# EAGLE design version1c (EAGLE 6.5.0)
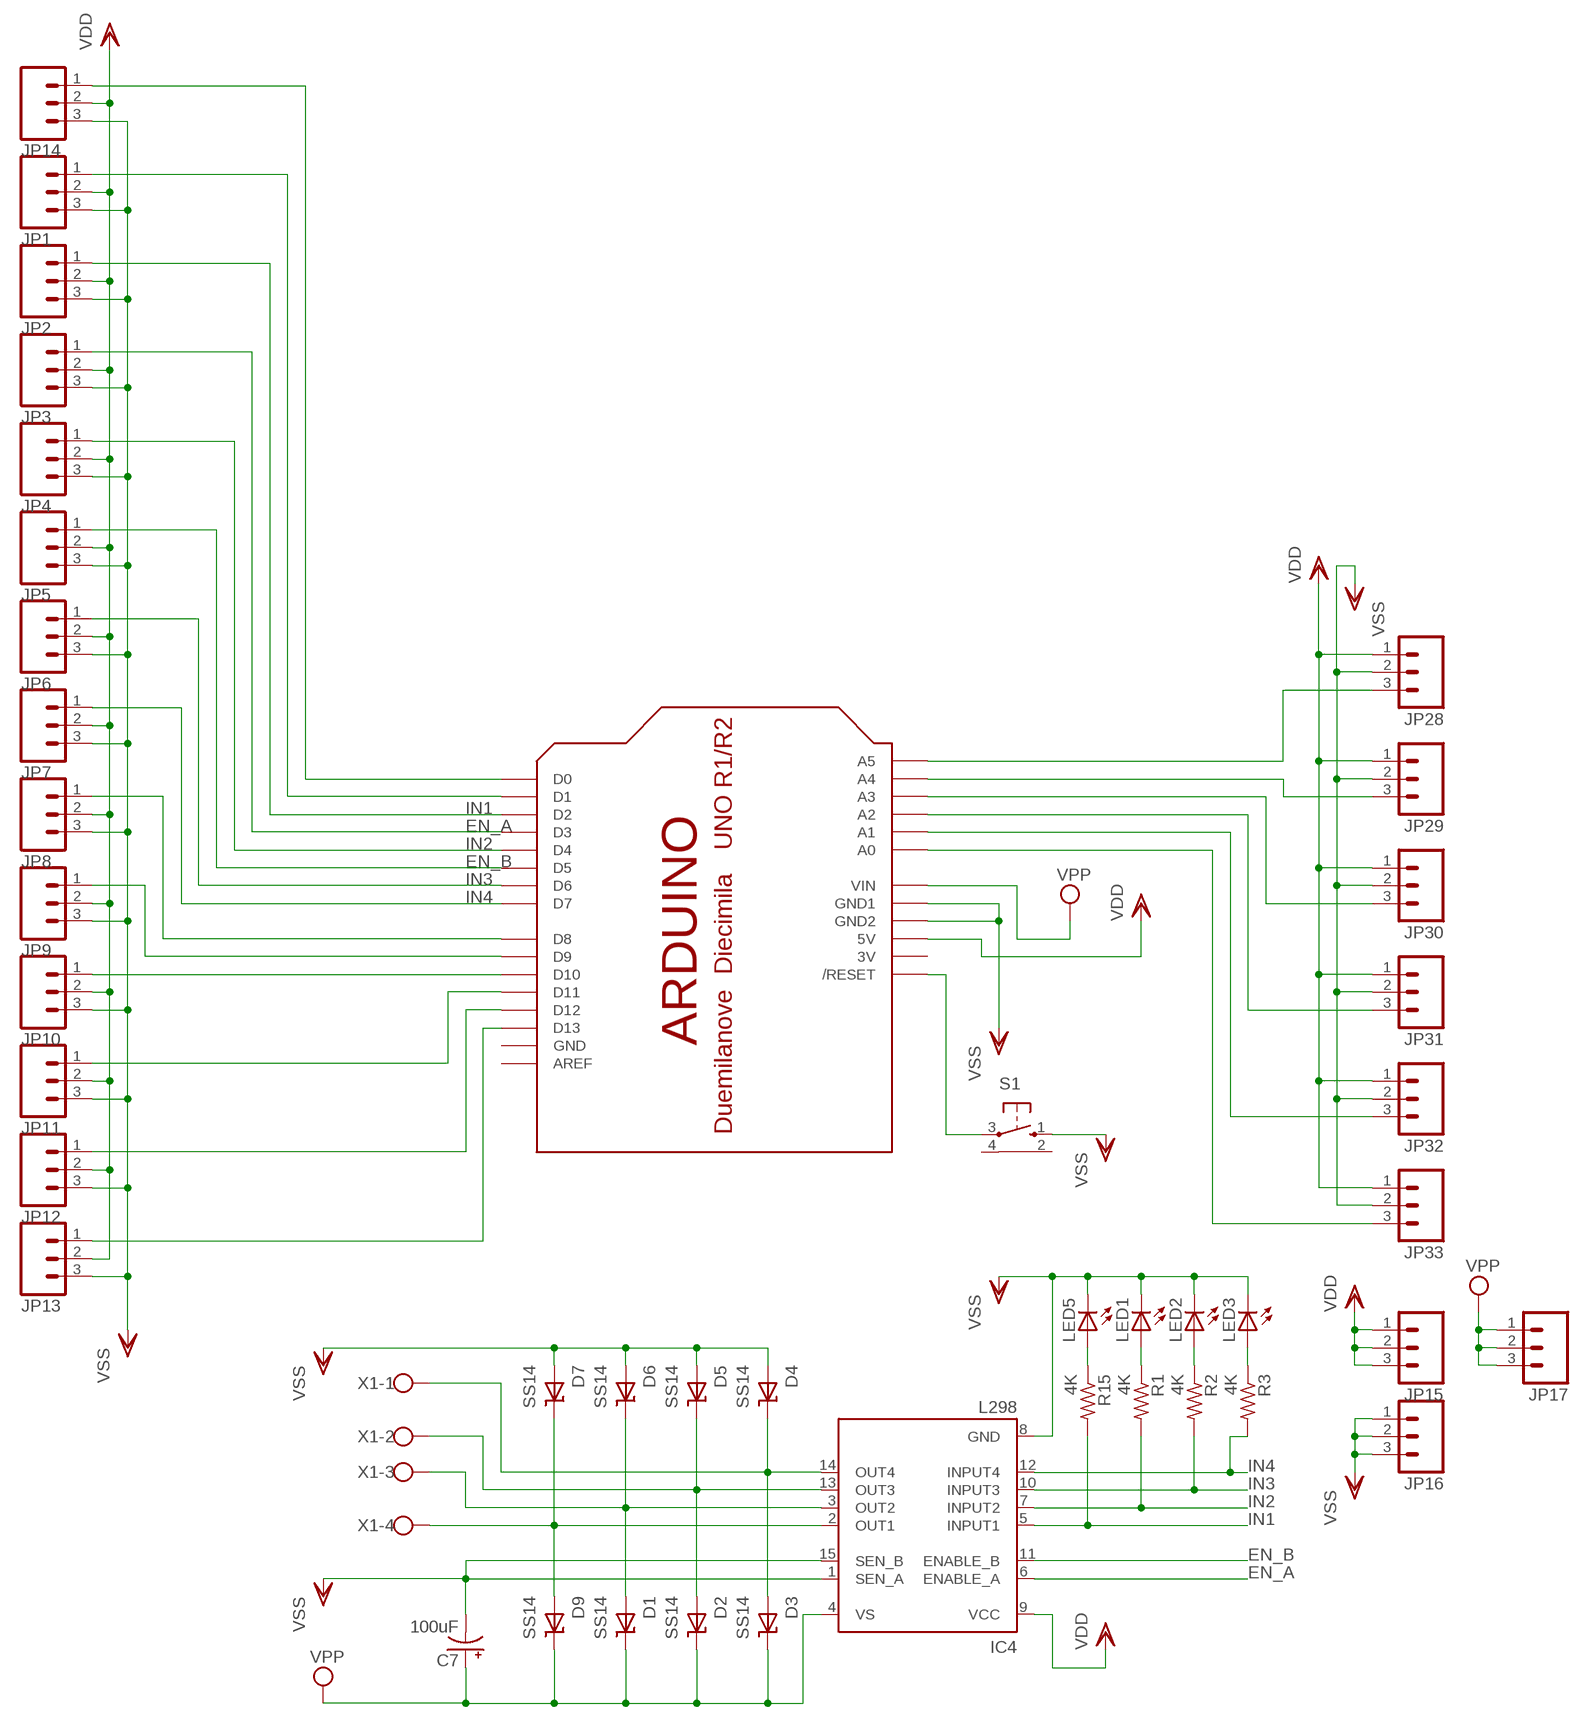
[diagram p0: schematic, sheet 1]

## Parts
C7  100uF  CPOL-US153CLV-0605  [153CLV-0605]
D1  SS14  [SMA]
D2  SS14  [SMA]
D3  SS14  [SMA]
D4  SS14  [SMA]
D5  SS14  [SMA]
D6  SS14  [SMA]
D7  SS14  [SMA]
D9  SS14  [SMA]
IC4  L298  [MULTIWATT-15]
JP1  M03PTH  [1X03]
JP2  M03PTH  [1X03]
JP3  M03PTH  [1X03]
JP4  M03PTH  [1X03]
JP5  M03PTH  [1X03]
JP6  M03PTH  [1X03]
JP7  M03PTH  [1X03]
JP8  M03PTH  [1X03]
JP9  M03PTH  [1X03]
JP10  M03PTH  [1X03]
JP11  M03PTH  [1X03]
JP12  M03PTH  [1X03]
JP13  M03PTH  [1X03]
JP14  M03PTH  [1X03]
JP15  M03PTH  [1X03]
JP16  M03PTH  [1X03]
JP17  M03PTH  [1X03]
JP28  M03PTH  [1X03]
JP29  M03PTH  [1X03]
JP30  M03PTH  [1X03]
JP31  M03PTH  [1X03]
JP32  M03PTH  [1X03]
JP33  M03PTH  [1X03]
LED1  LEDCHIP-LED0805  [CHIP-LED0805]
LED2  LEDCHIP-LED0805  [CHIP-LED0805]
LED3  LEDCHIP-LED0805  [CHIP-LED0805]
LED5  LEDCHIP-LED0805  [CHIP-LED0805]
R1  4K  R-US_R0805  [R0805]
R2  4K  R-US_R0805  [R0805]
R3  4K  R-US_R0805  [R0805]
R15  4K  R-US_R0805  [R0805]
S1  10-XX-RPAD  [B3F-10XX-RPAD]
U$1  ARDUINO-NOHOLE  [ARDUINO-NOHOLE]
X1  W237-4  [W237-4]

## Nets
EN_A: IC4.6(ENABLE_A) JP3.1 U$1.D3
EN_B: IC4.11(ENABLE_B) JP5.1 U$1.D5
IN1: IC4.5(INPUT1) JP2.1 R15.2 U$1.D2
IN2: IC4.7(INPUT2) JP4.1 R1.2 U$1.D4
IN3: IC4.10(INPUT3) JP6.1 R2.2 U$1.D6
IN4: IC4.12(INPUT4) JP7.1 R3.2 U$1.D7
N$1: JP13.1 U$1.D13
N$2: JP12.1 U$1.D12
N$3: JP28.3 U$1.A5
N$4: JP11.1 U$1.D11
N$5: JP10.1 U$1.D10
N$6: JP29.3 U$1.A4
N$7: JP9.1 U$1.D9
N$8: JP8.1 U$1.D8
N$9: JP30.3 U$1.A3
N$10: LED3.A R3.1
N$11: LED2.A R2.1
N$12: JP31.3 U$1.A2
N$13: LED1.A R1.1
N$14: LED5.A R15.1
N$16: JP33.3 U$1.A0
N$17: JP32.3 U$1.A1
N$19: JP1.1 U$1.D1
N$20: JP14.1 U$1.D0
N$22: S1.3(P) U$1.RESET(/RESET)
N$24: D7.P$1(K) D9.P$2(A) IC4.2(OUT1) X1.4
N$25: D1.P$2(A) D6.P$1(K) IC4.3(OUT2) X1.3
N$27: D2.P$2(A) D5.P$1(K) IC4.13(OUT3) X1.2
N$28: D3.P$2(A) D4.P$1(K) IC4.14(OUT4) X1.1
VDD: IC4.9(VCC) JP1.2 JP2.2 JP3.2 JP4.2 JP5.2 JP6.2 JP7.2 JP8.2 JP9.2 JP10.2 JP11.2 JP12.2 JP13.2 JP14.2 JP15.1 JP15.2 JP15.3 JP28.1 JP29.1 JP30.1 JP31.1 JP32.1 JP33.1 U$1.5V
VPP: C7.+ D1.P$1(K) D2.P$1(K) D3.P$1(K) D9.P$1(K) IC4.4(VS) JP17.1 JP17.2 JP17.3 U$1.VIN
VSS: C7.- D4.P$2(A) D5.P$2(A) D6.P$2(A) D7.P$2(A) IC4.1(SEN_A) IC4.8(GND) IC4.15(SEN_B) JP1.3 JP2.3 JP3.3 JP4.3 JP5.3 JP6.3 JP7.3 JP8.3 JP9.3 JP10.3 JP11.3 JP12.3 JP13.3 JP14.3 JP16.1 JP16.2 JP16.3 JP28.2 JP29.2 JP30.2 JP31.2 JP32.2 JP33.2 LED1.C LED2.C LED3.C LED5.C S1.1(S) U$1.GND1 U$1.GND2
Unconnected: S1.2(GND1) S1.4(GND2) U$1.AREF

## Power pins joined to a net without a drawn wire
3V: U$1.3V
GND: U$1.GND

## Library data of the parts
C7 = adafruit:CPOL-US: POLARIZED CAPACITOR, American symbol
D1-D7 D9 = SmartPrj:SS14: DIODE SS14 Diode Schottky 1A 40v
IC4 = st-microelectronics:L298: DUAL FULL-BRIDGE DRIVER; MPN: L298N; OC_FARNELL: 1589425; OC_NEWARK: 32M1527
JP1-JP17 JP28-JP33 = SparkFun:M03: Header 3 Standard 3-pin 0.1" header. Use with straight break away headers (SKU : PRT-00116), right angle break away headers (PRT-00553), swiss pins (PRT-00743), machine pins (PRT-00117), and female headers (PRT-00115). Molex polarized connector foot print use with SKU : PRT-08232 with associated crimp pins and housings.
LED1-LED3 LED5 = led:LED: LED OSRAM: - CHIPLED LG R971, LG N971, LY N971, LG Q971, LY Q971, LO R971, LY R971 LH N974, LH R974 LS Q976, LO Q976, LY Q976 LO Q996 - Hyper CHIPLED LW Q18S LB Q993, LB Q99A, LB R99A - SideLED LS A670, LO A670, LY A670, LG A670, LP A670 LB A673, LV A673, LT A673, LW A673 LH A674 LY A675 LS A676, LA A676, LO A676, LY A676, LW A676 LS A679, LY A679, LG A679 - Hyper Micro SIDELED® LS Y876, LA Y876, LO Y876, LY Y876 LT Y87S - SmartLED LW L88C, LW L88S LB L89C, LB L89S, LG L890 LS L89K, LO L89K, LY L89K LS L896, LA L896, LO L896, LY L896 - TOPLED LS T670, LO T670, LY T670, LG T670, LP T670 LSG T670, LSP T670, LSY T670, LOP T670, LYG T670 LG T671, LOG T671, LSG T671 LB T673, LV T673, LT T673, LW T673 LH T674 LS T676, LA T676, LO T676, LY T676, LB T676, LH T676, LSB T676, LW T676 LB T67C, LV T67C, LT T67C, LS T67K, LO T67K, LY T67K, LW E67C LS E67B, LA E67B, LO E67B, LY E67B, LB E67C, LV E67C, LT E67C LW T67C LS T679, LY T679, LG T679 LS T770, LO T770, LY T770, LG T770, LP T770 LB T773, LV T773, LT T773, LW T773 LH T774 LS E675, LA E675, LY E675, LS T675 LS T776, LA T776, LO T776, LY T776, LB T776 LHGB T686 LT T68C, LB T68C - Hyper Mini TOPLED® LB M676 - Mini TOPLED Santana® LG M470 LS M47K, LO M47K, LY M47K Source: http://www.osram.convergy.de LUXEON: - LUMILED® LXK2-PW12-R00, LXK2-PW12-S00, LXK2-PW14-U00, LXK2-PW14-V00 LXK2-PM12-R00, LXK2-PM12-S00, LXK2-PM14-U00 LXK2-PE12-Q00, LXK2-PE12-R00, LXK2-PE12-S00, LXK2-PE14-T00, LXK2-PE14-U00 LXK2-PB12-K00, LXK2-PB12-L00, LXK2-PB12-M00, LXK2-PB14-N00, LXK2-PB14-P00, LXK2-PB14-Q00 LXK2-PR12-L00, LXK2-PR12-M00, LXK2-PR14-Q00, LXK2-PR14-R00 LXK2-PD12-Q00, LXK2-PD12-R00, LXK2-PD12-S00 LXK2-PH12-R00, LXK2-PH12-S00 LXK2-PL12-P00, LXK2-PL12-Q00, LXK2-PL12-R00 Source: www.luxeon.com KINGBRIGHT: KA-3528ASYC Source: www.kingbright.com
R1-R3 R15 = adafruit:R-US_: RESISTOR, American symbol
S1 = repRapr:10-XX-RPAD: OMRON SWITCH
U$1 = adafruit:ARDUINO: Arduino Diecimila/Duemilanove Make a shield with ease, this package has all the named pins as well as the two mounting drill holes and an outline of the USB and DC power connector. The outline is on the DIMENSION layer, so if your board house uses it they will cut the outline to match. http://www.ladyada.net/library/pcb/eaglelibrary.html
X1 = con-wago-500:W237-4: WAGO SCREW CLAMP; OC_FARNELL: unknown; OC_NEWARK: unknown

## Board
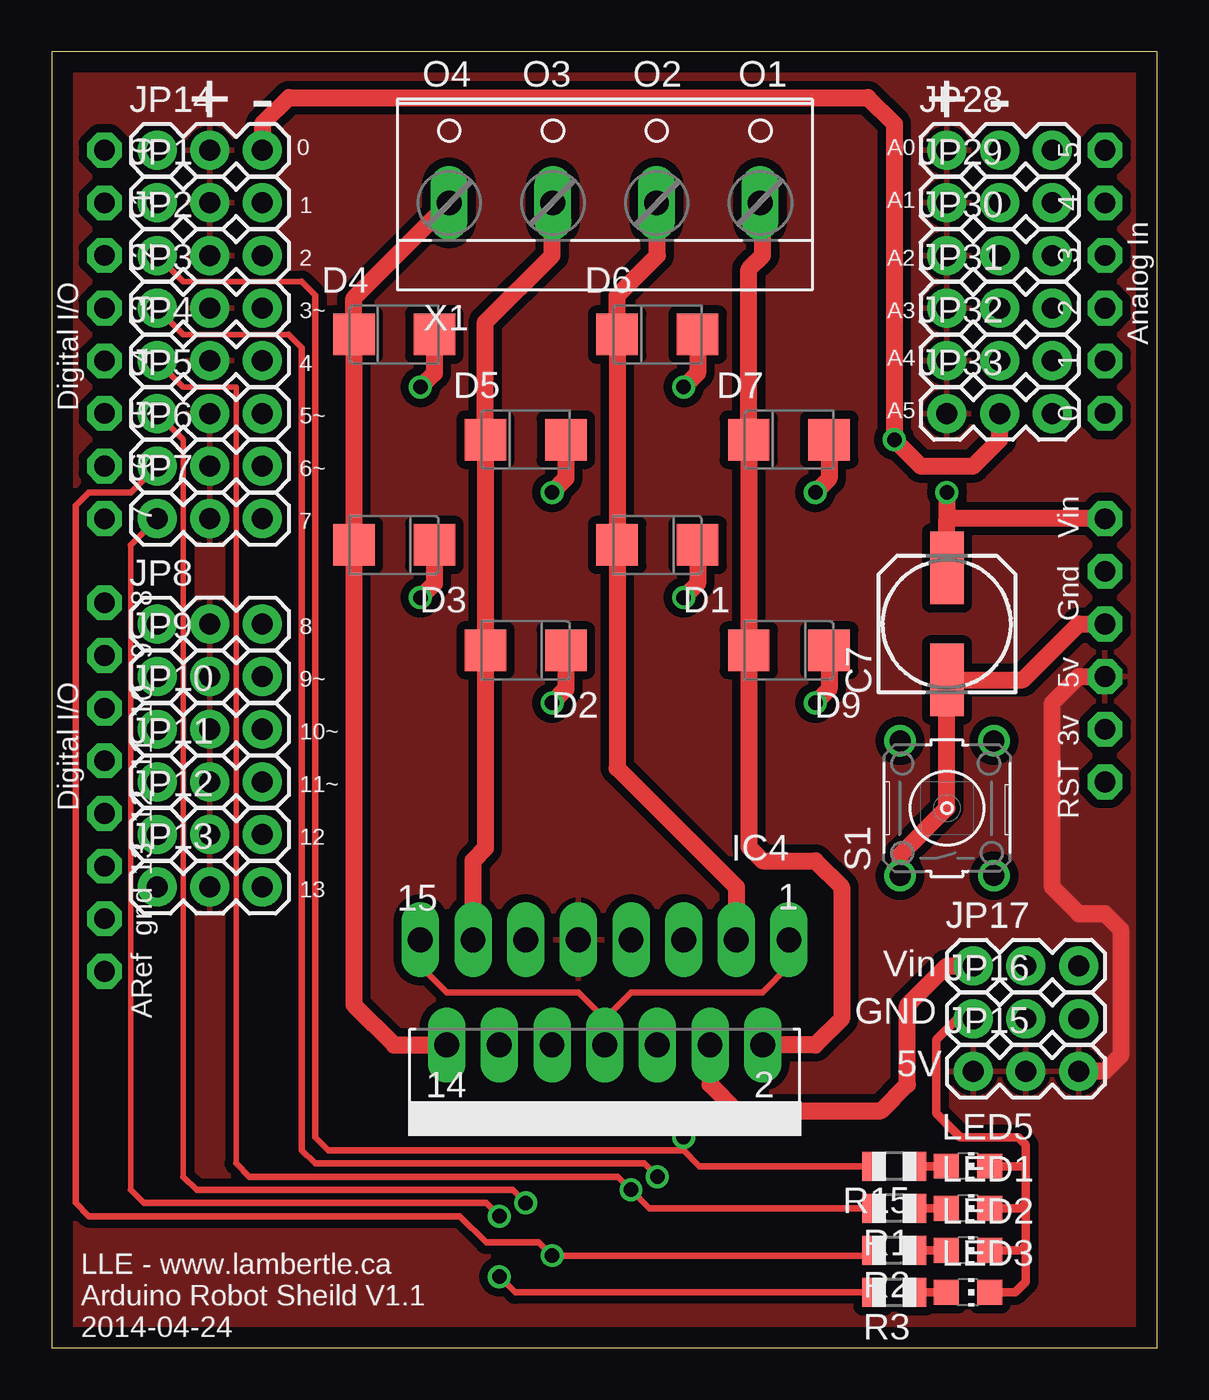
[diagram p1: board, top side]
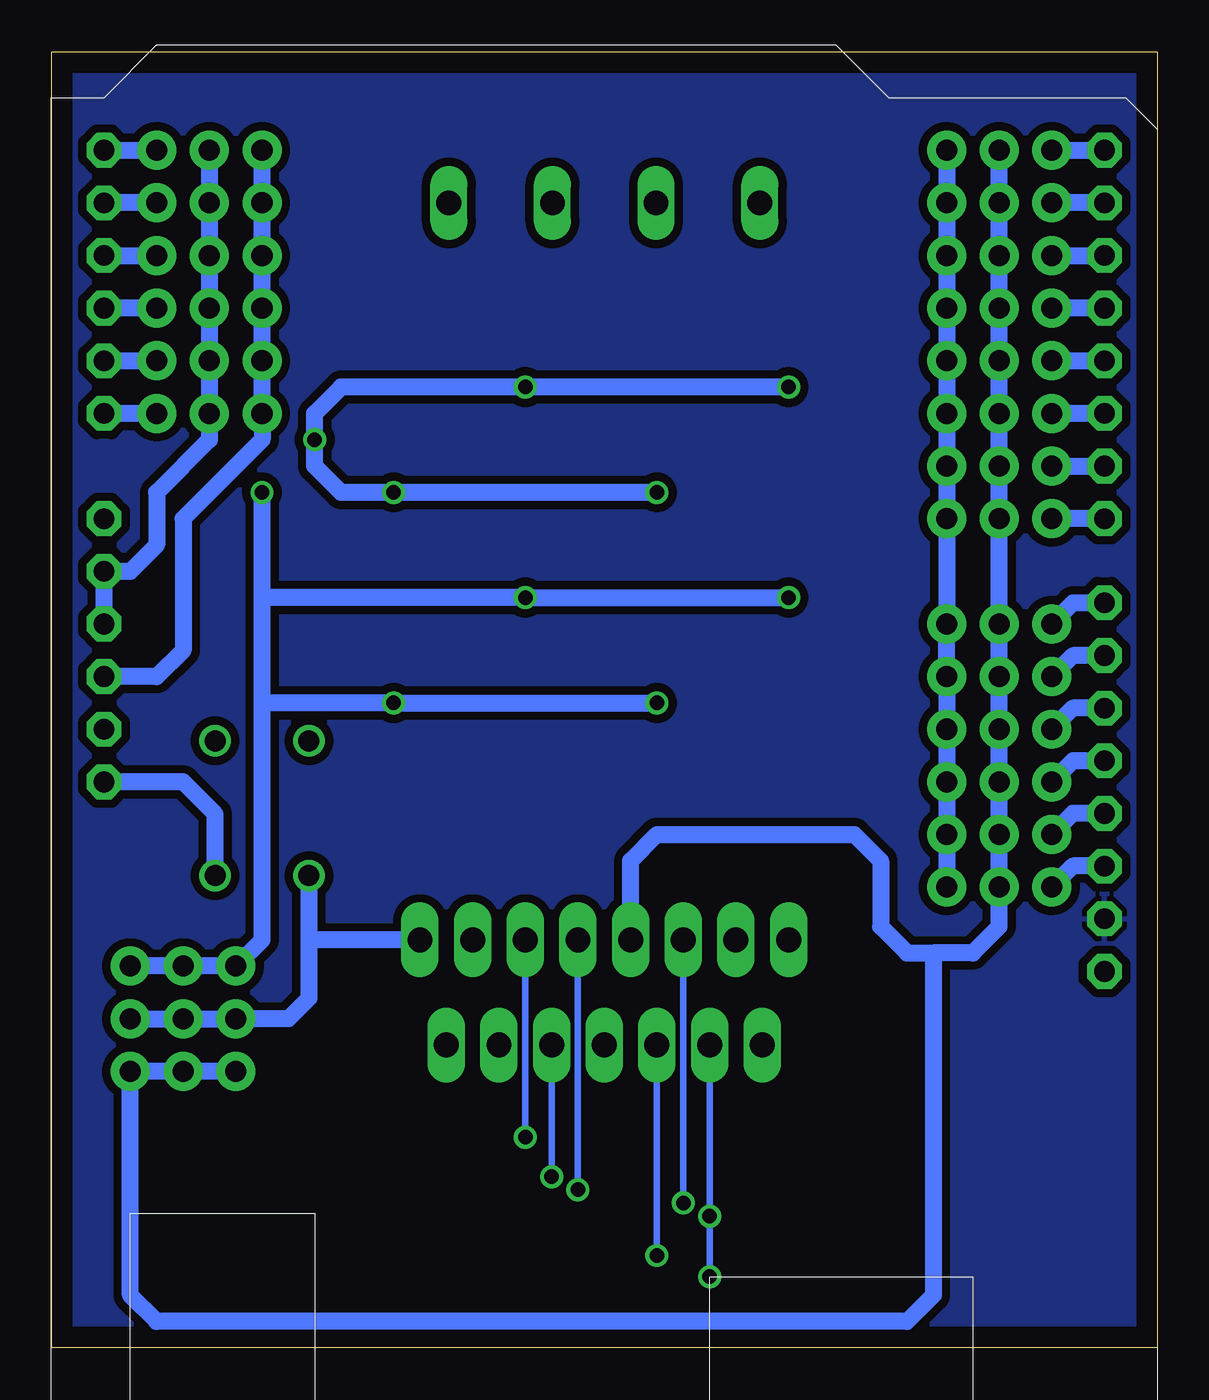
[diagram p2: board, bottom side, seen from below]

Size 53.32 x 62.53 mm. Coordinates in mm from the lower left corner, seen from the top.
Outline: 0,0 53.32,0 53.32,62.53 0,62.53 0,0
Copper layers (1*16): Top 0.035mm / dielectric 1.5mm / Bottom 0.035mm
Design rules "default": minimum track width 10mil, minimum drill 24mil, track to track 8mil, track to pad 8mil, pad to pad 8mil, via to via 8mil, smd to smd 8mil, copper to edge 40mil, drill to drill 8mil, minimum pad ring 10mil, minimum via ring 8mil, stop-mask expansion 4mil, vias tented up to drill 0mil, thermal gap 10mil

### Footprints (pad centres in the part's own frame; a part is rotated, then mirrored left to right if it is on the bottom)
153CLV-0605 = smd 3.5 x 1.6: + 2.7,0; - -2.7,0
SMA = smd 2 x 2: P$1 -1.94,0; P$2 1.94,0
MULTIWATT-15 = drill 1.2 long: 1 -8.89,-7.62; 2 -7.62,-2.54; 3 -6.35,-7.62; 4 -5.08,-2.54; 5 -3.81,-7.62; 6 -2.54,-2.54; 7 -1.27,-7.62; 8 0,-2.54; 9 1.27,-7.62; 10 2.54,-2.54; 11 3.81,-7.62; 12 5.08,-2.54; 13 6.35,-7.62; 14 7.62,-2.54; 15 8.89,-7.62
1X03 = drill 1.016 pad 1.88: 1 0,0; 2 2.54,0; 3 5.08,0
CHIP-LED0805 = smd 1.2 x 1.2: A 0,-1.05; C 0,1.05
R0805 = smd 1.1 x 1.4: 1 -1,0; 2 1,0
B3F-10XX-RPAD = drill 1.016: 1 -3.251,2.261; 2 3.251,2.261; 3 -3.251,-2.261; 4 3.251,-2.261
ARDUINO-NOHOLE = drill 1 pad 1.676 octagon: 3V 35.56,2.54; 5V 38.1,2.54; A0 50.8,2.54; A1 53.34,2.54; A2 55.88,2.54; A3 58.42,2.54; A4 60.96,2.54; A5 63.5,2.54; AREF 23.876,50.8; D0 63.5,50.8; D1 60.96,50.8; D2 58.42,50.8; D3 55.88,50.8; D4 53.34,50.8; D5 50.8,50.8; D6 48.26,50.8; D7 45.72,50.8; D8 41.656,50.8; D9 39.116,50.8; D10 36.576,50.8; D11 34.036,50.8; D12 31.496,50.8; D13 28.956,50.8; GND 26.416,50.8; GND1 43.18,2.54; GND2 40.64,2.54; RESET 33.02,2.54; VIN 45.72,2.54
W237-4 = drill 1.194 long: 1 -7.5,-1.27; 2 -2.5,-1.27; 3 2.5,-1.27; 4 7.5,-1.27

### Placement (x,y rotation side)
C7  43.18,34.92 90 top
D1  29.21,38.73 180 top
D2  22.86,33.66 180 top
D3  16.51,38.73 180 top
D4  16.51,48.89 0 top
D5  22.86,43.81 0 top
D6  29.21,48.89 0 top
D7  35.56,43.81 0 top
D9  35.56,33.66 180 top
IC4  26.67,12.07 180 top
JP1  5.08,55.25 0 top
JP2  5.08,52.7 0 top
JP3  5.08,50.17 0 top
JP4  5.08,47.62 0 top
JP5  5.08,45.08 0 top
JP6  5.08,42.55 0 top
JP7  5.08,40 0 top
JP8  5.08,34.92 0 top
JP9  5.08,32.39 0 top
JP10  5.08,29.85 0 top
JP11  5.08,27.31 0 top
JP12  5.08,24.77 0 top
JP13  5.08,22.23 0 top
JP14  5.08,57.78 0 top
JP15  44.45,13.34 0 top
JP16  44.45,15.88 0 top
JP17  44.45,18.41 0 top
JP28  43.18,57.78 0 top
JP29  43.18,55.25 0 top
JP30  43.18,52.7 0 top
JP31  43.18,50.17 0 top
JP32  43.18,47.62 0 top
JP33  43.18,45.08 0 top
LED1  44.2,6.73 270 top
LED2  44.2,4.7 270 top
LED3  44.2,2.67 270 top
LED5  44.2,8.76 270 top
R1  40.64,6.73 180 top
R2  40.64,4.7 180 top
R3  40.64,2.67 180 top
R15  40.64,8.76 180 top
S1  43.18,26.04 90 top
U$1  53.34,-5.71 90 top
X1  26.67,56.52 0 top

### Tracks (layer width: path | path; a pad name or v marks a point on that pad's centre or on a via)
EN_A  (via drill 0.7)
  Top 0.254: JP3.1 6.35,48.89 11.43,48.89
  Top 0.305: 11.43,48.89 12.06,48.26 12.06,9.53 12.7,8.89 28.57,8.89 v29.21,8.26
  Bottom 0.305: v29.21,8.26 IC4.6
  Bottom 0.813: U$1.D3 JP3.1
EN_B  (via drill 0.7)
  Top 0.254: JP5.1 6.35,43.81 6.35,8.26
  Top 0.305: 6.35,8.26 6.99,7.62 22.23,7.62 v22.86,6.98
  Bottom 0.305: v22.86,6.98 IC4.11
  Bottom 0.813: U$1.D5 JP5.1
GND
  pour Bottom (isolate 0.406): 0,0 0,62.48 53.34,62.48 53.34,0
IN1  (via drill 0.7)
  Top 0.254: JP2.1 6.35,51.44 12.06,51.44
  Top 0.305: 12.06,51.44 12.7,50.8 12.7,10.16 13.34,9.53 30.48,9.53 | 30.48,9.53 v30.48,10.16 | R15.2 31.24,8.76 30.48,9.53
  Bottom 0.305: v30.48,10.16 IC4.5
  Bottom 0.813: JP2.1 U$1.D2
IN2  (via drill 0.7)
  Top 0.254: JP4.1 6.35,46.36 8.89,46.36 8.89,8.89
  Top 0.305: 8.89,8.89 9.53,8.26 27.3,8.26 v27.94,7.62 28.83,6.73 R1.2
  Bottom 0.305: v27.94,7.62 IC4.7
  Bottom 0.813: JP4.1 U$1.D4
IN3  (via drill 0.7)
  Top 0.305: JP6.1 3.81,41.28 1.78,41.28 1.14,40.64 1.14,6.98 1.78,6.35 19.68,6.35 20.95,5.08 23.5,5.08 v24.13,4.45 39.39,4.45 R2.2
  Bottom 0.305: v24.13,4.45 IC4.10
  Bottom 0.813: JP6.1 U$1.D6
IN4  (via drill 0.7)
  Top 0.254: 3.81,38.73 3.81,7.62
  Top 0.305: JP7.1 3.81,38.73 | 3.81,7.62 4.45,6.98 20.95,6.98 v21.59,6.35 | R3.2 22.35,2.67 v21.59,3.43
  Bottom 0.305: IC4.12 v21.59,6.35 v21.59,3.43
  Bottom 0.813: U$1.D7 JP7.1
N$1
  Bottom 0.813: U$1.D13 4.06,23.24 JP13.1
N$2
  Bottom 0.813: U$1.D12 4.06,25.78 JP12.1
N$3
  Bottom 0.813: U$1.A5 JP28.3
N$4
  Bottom 0.813: U$1.D11 4.06,28.32 JP11.1
N$5
  Bottom 0.813: U$1.D10 4.06,30.86 JP10.1
N$6
  Bottom 0.813: JP29.3 U$1.A4
N$7
  Bottom 0.813: U$1.D9 4.06,33.4 JP9.1
N$8
  Bottom 0.813: U$1.D8 4.06,35.94 JP8.1
N$9
  Bottom 0.813: U$1.A3 JP30.3
N$10
  Top 0.406: LED3.A R3.1
N$11
  Top 0.406: R2.1 LED2.A
N$12
  Bottom 0.813: JP31.3 U$1.A2
N$13
  Top 0.406: LED1.A R1.1
N$14
  Top 0.406: R15.1 LED5.A
N$16
  Bottom 0.813: JP33.3 U$1.A0
N$17
  Bottom 0.813: U$1.A1 JP32.3
N$19
  Bottom 0.813: U$1.D1 JP1.1
N$20
  Bottom 0.813: JP14.1 U$1.D0
N$22
  Bottom 0.813: S1.3 45.44,25.76 46.99,27.31 U$1.RESET
N$24
  Top 0.813: X1.4 34.29,55.12 34.29,52.7 33.62,52.03 D7.P$1 D9.P$2 33.62,24.16 34.29,23.5 36.83,23.5 38.1,22.23 38.1,15.88 36.83,14.61 IC4.2
N$25
  Top 0.813: X1.3 29.21,55.2 29.21,52.7 27.27,50.77 D6.P$1 D1.P$2 27.27,27.97 33.02,22.23 IC4.3
N$27
  Top 0.813: X1.2 24.13,55.2 24.13,52.7 20.92,49.5 D5.P$1 D2.P$2 20.92,24.09 20.32,23.5 IC4.13
N$28
  Top 0.813: X1.1 14.57,50.64 D4.P$1 D3.P$2 14.57,16.55 16.51,14.61 IC4.14
VDD
  Top 0.813: U$1.5V 49.53,32.39 48.26,31.11 48.26,22.23 49.53,20.96 50.8,20.96 51.56,20.19 51.56,14.1 50.8,13.34 JP15.3
  Bottom 0.813: JP28.1 JP29.1 JP30.1 JP31.1 JP32.1 JP33.1 43.18,43.81 46.99,40 46.99,33.66 48.26,32.39 U$1.5V | IC4.9 25.4,23.5 24.13,24.77 14.61,24.77 13.34,23.5 13.34,20.32 12.06,19.05 10.79,19.05 | JP15.1 JP15.2 JP15.3 49.53,2.54 48.26,1.27 12.06,1.27 10.79,2.54 10.79,19.05 | JP14.2 JP1.2 JP2.2 JP3.2 JP4.2 JP5.2 JP6.2 JP7.2 JP8.2 JP9.2 JP10.2 JP11.2 JP12.2 JP13.2 7.62,20.32 8.89,19.05 10.79,19.05
  pour Top (isolate 0.406): 0,0 0,62.48 53.34,62.48 53.34,0
VPP  (via drill 0.7)
  Top 0.813: U$1.VIN 43.18,40 | C7.+ 43.18,40 | v43.18,41.28 43.18,40 | D3.P$1 18.45,36.86 v17.78,36.19 | D1.P$1 31.15,36.86 v30.48,36.19 | D9.P$1 37.5,31.79 v36.83,31.11 | D2.P$1 24.8,31.79 v24.13,31.11 | IC4.4 31.75,12.7 33.02,11.43 40.01,11.43 41.27,12.7 41.27,16.51 43.18,18.41 JP17.1
  Bottom 0.813: 43.18,31.11 43.18,19.68 JP17.1 JP17.2 JP17.3 | 43.18,31.11 43.18,36.19 | 43.18,36.19 v43.18,41.28 | v17.78,36.19 v30.48,36.19 43.18,36.19 | v24.13,31.11 v36.83,31.11 43.18,31.11
VSS  (via drill 0.7)
  Top 0.305: IC4.15 17.78,18.41 19.05,17.14 25.4,17.14 26.67,15.88 | 26.67,15.88 IC4.8 | IC4.1 35.56,18.41 34.29,17.14 27.94,17.14 26.67,15.88
  Top 0.406: 46.99,4.95 46.99,3.18 46.48,2.67 LED3.C | 46.99,4.95 46.99,6.98 | 46.99,6.98 46.99,8.89 | 46.99,8.89 46.99,9.78 46.61,10.16 43.81,10.16 42.67,11.3 42.67,14.86 43.69,15.88 JP16.1 | LED5.C 46.86,8.76 46.99,8.89 | LED1.C 46.74,6.73 46.99,6.98 | 46.99,4.95 46.74,4.7 LED2.C
  Top 0.813: S1.1 40.92,23.77 43.18,26.04 C7.- 46.83,32.22 49.53,34.92 U$1.GND2 | D4.P$2 18.45,47.03 v17.78,46.36 | D5.P$2 24.8,41.94 v24.13,41.28 | D6.P$2 31.15,47.03 v30.48,46.36 | D7.P$2 37.5,41.94 v36.83,41.28 | JP33.2 45.72,43.81 44.45,42.55 41.91,42.55 v40.64,43.81 40.64,59.05 39.37,60.33 11.43,60.33 10.16,59.05 JP14.3
  Bottom 0.813: JP28.2 JP29.2 JP30.2 JP31.2 JP32.2 JP33.2 45.72,43.81 48.26,41.28 48.26,38.73 49.53,37.47 U$1.GND1 U$1.GND2 | S1.1 40.92,19.68 | 40.92,19.68 40.92,16.87 41.91,15.88 JP16.1 JP16.2 JP16.3 | v17.78,46.36 v30.48,46.36 39.37,46.36 40.64,45.08 v40.64,43.81 40.64,42.55 39.37,41.28 v36.83,41.28 v24.13,41.28 | IC4.1 40.92,19.68 | JP13.3 JP12.3 JP11.3 JP10.3 JP9.3 JP8.3 JP7.3 JP6.3 JP5.3 JP4.3 JP3.3 JP2.3 JP1.3 JP14.3

### Text on the board
BD-Top: RESET | IN1 | IN2 | IN3 | IN4 | DIRECTION
_tsilk: O4 | O3 | O2 | O1 | + | - | + | - | 0 | A0 | A1 | 1 | 2 | A2 | 3~ | A3 | 4 | A4 | A5 | 5~ | 6~ | 7 | 8 | 9~ | 10~ | 11~ | 12 | 13 | Vin | GND | 5V | LLE - www.lambertle.ca / Arduino Robot Sheild V1.1 / 2014-04-24